# Altium schematic sheet twentyfour.SchDoc
size A4
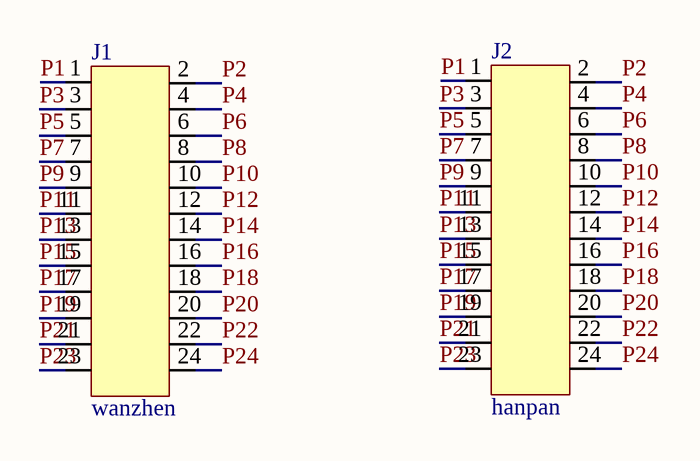
[diagram p0: twentyfour.SchDoc]

## Parts
J1  wanzhen  [wanzhen]
J2  hanpan  [hanpan]

## Nets
P1: J1.1 J2.1
P2: J1.2 J2.2
P3: J1.3 J2.3
P4: J1.4 J2.4
P5: J1.5 J2.5
P6: J1.6 J2.6
P7: J1.7 J2.7
P8: J1.8 J2.8
P9: J1.9 J2.9
P10: J1.10 J2.10
P11: J1.11 J2.11
P12: J1.12 J2.12
P13: J1.13 J2.13
P14: J1.14 J2.14
P15: J1.15 J2.15
P16: J1.16 J2.16
P17: J1.17 J2.17
P18: J1.18 J2.18
P19: J1.19 J2.19
P20: J1.20 J2.20
P21: J1.21 J2.21
P22: J1.22 J2.22
P23: J1.23 J2.23
P24: J1.24 J2.24

## Library data of the parts
J1 = wanzhen: 弯针
J2 = hanpan: 焊盘